# Altium schematic sheet Clock.SchDoc: Valós idejű óra
size A4; Author: Tabajdi Máté; Organization: BME - AUT; DocumentNumber: 2; Revision: 19.; SheetNumber: 2; SheetTotal: 3
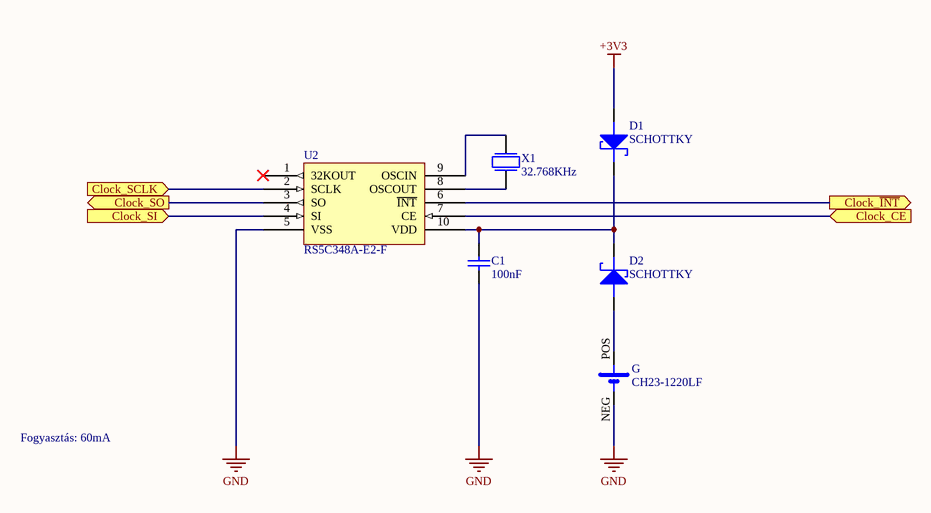
[diagram p0: Clock.SchDoc]

## Parts
C1  100nF  [FP_0805_CAP_085]
D1  SCHOTTKY  [FP_SOD323-F]
D2  SCHOTTKY  [FP_SOD323-F]
G  CH23-1220LF  [CH23-1220LF]
U2  RS5C348A-E2-F  [TSSOP50P640X135-10M]
X1  32.768KHz  [NXG 2x6 footprint]

## Ports
Clock_CE (in), Clock_SCLK (in), Clock_SI (in), Clock_SO (out), Clock_~{INT} (out)

## Nets
+3V3: D1.1(ANODE)
GND: C1.1 G.NEG U2.5(VSS)
Clock_CE: U2.7(CE) ; port Clock_CE
Clock_~{INT}: U2.6(~{INT}) ; port Clock_~{INT}
Clock_SCLK: U2.2(SCLK) ; port Clock_SCLK
Clock_SI: U2.4(SI) ; port Clock_SI
Clock_SO: U2.3(SO) ; port Clock_SO
NetC1_2: C1.2 D1.2(CATHODE) D2.2(CATHODE) U2.10(VDD)
NetD2_1: D2.1(ANODE) G.POS
NetU2_8: U2.8(OSCOUT) X1.2
NetU2_9: U2.9(OSCIN) X1.1

Not connected (* = marked no-connect by the designer): U2 1(32KOUT)*

## Notes on the sheet
- Fogyasztás: 60mA
- Title
- Size:
- Date:
- A4
- Number:
- Time:
- Revision:
- Sheet
- of
- File:

## Library data of the parts
C1 = CAP: Capacitor; Tolerance: 10%; Voltage: 50V; Name: 100nF 0805 10% 50V X7R 0805B104K500NT (FNG); Supplier: Lomex; Reference: 82-13-46; Value: 100nF
D1 D2 = SCHOTTKY: Schottky diode; Reference: 1972726; Name: PMEG6002EJ,115 Schottky Rectifier; Supplier: Farnell
G = CH23-1220LF: BATTERY HOLDER, DIP, 12MM; Accessory Type: Coin Cell Battery Holder; For Use With: 1220 Coin Cell Batteries; Battery ...; Value: 3V; MF: Multicomp; Reference: 2064721; Name: CH23-1220LF elemtartó; Price: None; Package: None; Availability: Unavailable; MP: CH23-1220LF; SnapEDA_Link: https://www.snapeda.com/parts/CH23-1220LF/Multicomp/view-part/575172/?ref=snap; Supplier: Farnell
U2 = RS5C348A-E2-F: Real-time clock; Reference: RIC011; Supplier: ChipCAD; Name: RS5C348A-E2-F
X1 = Crystal: Quarz Crystal; Name: 32.768kHz QUARZ D=2x6mm NXG (NSK) DT-26 ˝20ppm 12.5pF ORAQUARZ; Value: 32.768KHz; Reference: 40-00-51; Supplier: Lomex